# EAGLE design analog3-x893 (EAGLE 7.2.0)
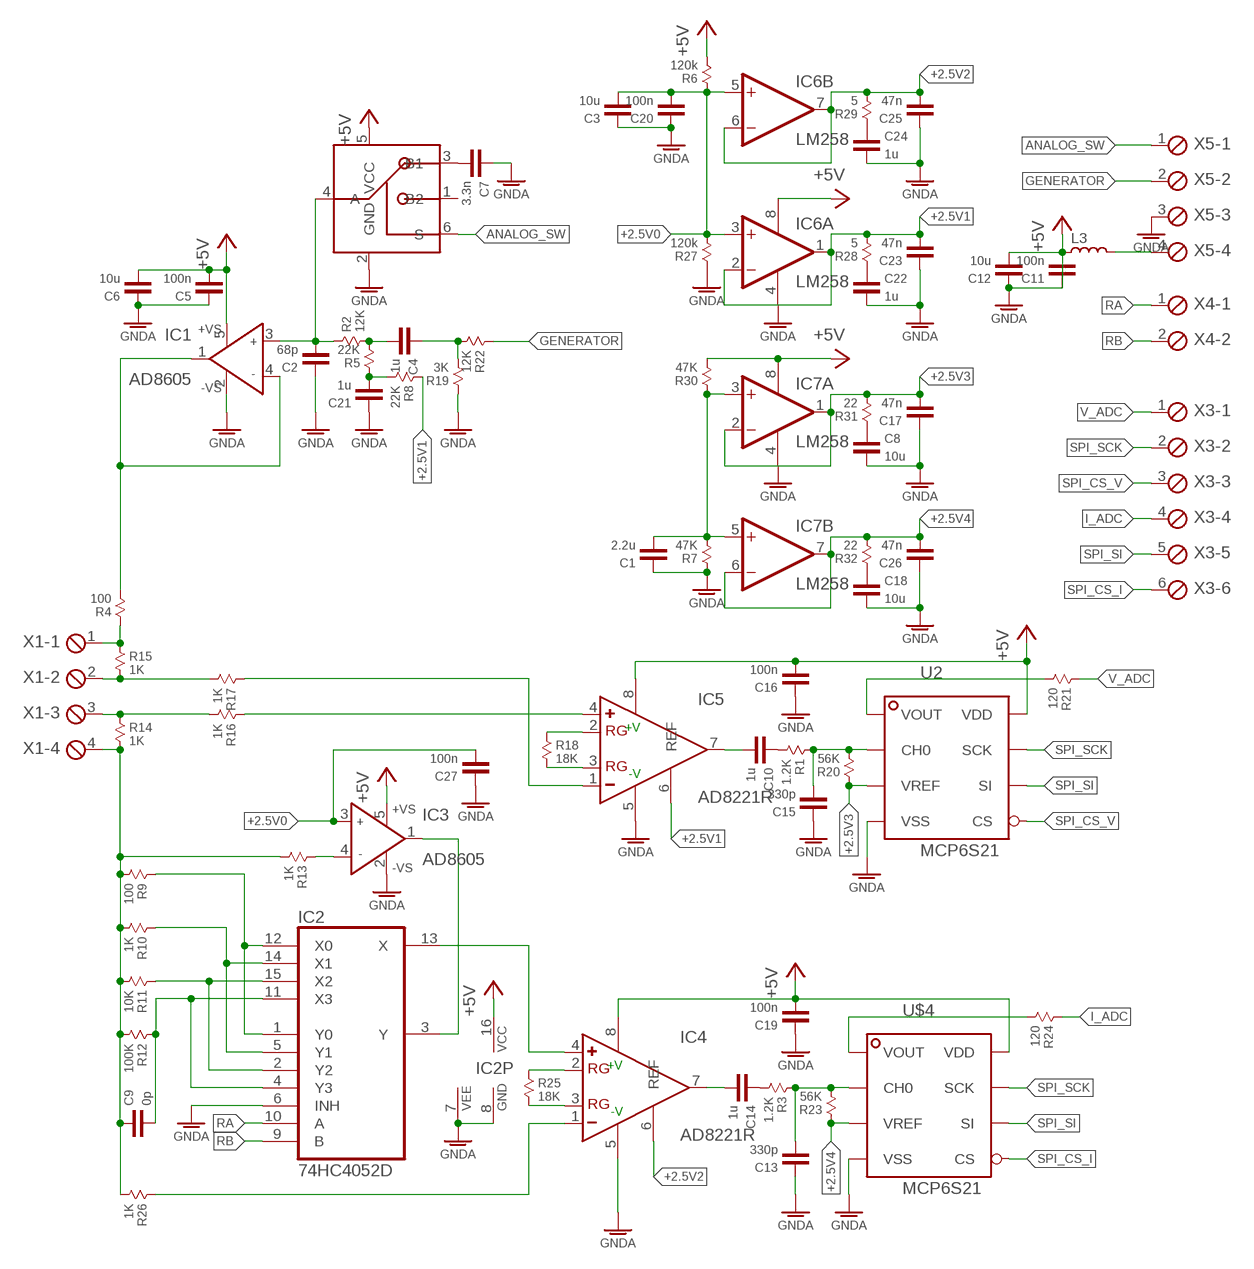
[diagram p0: schematic, sheet 1]

## Parts
C1  2.2u  CAP-0603  [0603]
C2  68p  CAP-0603  [0603]
C3  10u  CAP-0603  [0603]
C4  1u  CAP-0603  [0603]
C5  100n  CAP-0603  [0603]
C6  10u  CAP-0603  [0603]
C7  3.3n  CAP-0603  [0603]
C8  10u  CAP-0603  [0603]
C9  0p  CAP-0603  [0603]
C10  1u  CAP-0603  [0603]
C11  100n  CAP-0603  [0603]
C12  10u  CAP-0603  [0603]
C13  330p  CAP-0603  [0603]
C14  1u  CAP-0603  [0603]
C15  330p  CAP-0603  [0603]
C16  100n  CAP-0603  [0603]
C17  47n  CAP-0603  [0603]
C18  10u  CAP-0603  [0603]
C19  100n  CAP-0603  [0603]
C20  100n  CAP-0603  [0603]
C21  1u  CAP-0603  [0603]
C22  1u  CAP-0603  [0603]
C23  47n  CAP-0603  [0603]
C24  1u  CAP-0603  [0603]
C25  47n  CAP-0603  [0603]
C26  47n  CAP-0603  [0603]
C27  100n  CAP-0603  [0603]
IC1  AD8605  AD8603UJ  [SOT23-5]
IC2  74HC4052D  4052D  [SO16]
IC3  AD8605  AD8603UJ  [SOT23-5]
IC4  AD8221R  [SO8]
IC5  AD8221R  [SO8]
IC6  LM258  LM358D  [SO08]
IC7  LM258  LM358D  [SO08]
L3  INDUCTOR-0603  [0603]
R1  1.2K  RESISTOR-0603  [0603]
R2  12K  RESISTOR-0603  [0603]
R3  1.2K  RESISTOR-0603  [0603]
R4  100  RESISTOR-0603  [0603]
R5  22K  RESISTOR-0603  [0603]
R6  120k  RESISTOR-0603  [0603]
R7  47K  RESISTOR-0603  [0603]
R8  22K  RESISTOR-0603  [0603]
R9  100  RESISTOR-0603  [0603]
R10  1K  RESISTOR-0603  [0603]
R11  10K  RESISTOR-0603  [0603]
R12  100K  RESISTOR-0603  [0603]
R13  1K  RESISTOR-0603  [0603]
R14  1K  RESISTOR-0603  [0603]
R15  1K  RESISTOR-0603  [0603]
R16  1K  RESISTOR-0603  [0603]
R17  1K  RESISTOR-0603  [0603]
R18  18K  RESISTOR-0603  [0603]
R19  3K  RESISTOR-0603  [0603]
R20  56K  RESISTOR-0603  [0603]
R21  120  RESISTOR-0603  [0603]
R22  12K  RESISTOR-0603  [0603]
R23  56K  RESISTOR-0603  [0603]
R24  120  RESISTOR-0603  [0603]
R25  18K  RESISTOR-0603  [0603]
R26  1K  RESISTOR-0603  [0603]
R27  120k  RESISTOR-0603  [0603]
R28  5  RESISTOR-0603  [0603]
R29  5  RESISTOR-0603  [0603]
R30  47K  RESISTOR-0603  [0603]
R31  22  RESISTOR-0603  [0603]
R32  22  RESISTOR-0603  [0603]
U2  MCP6S21  [SO8]
U$1  SN74LVC1G3157DBVR  [SOT23-6]
U$4  MCP6S21  [SO8]
X1  MPT4  [4POL254]
X3  MPT6  [6POL254]
X4  MPT2  [2POL254]
X5  MPT4  [4POL254]

## Nets
+2.5V0: C3.1 C20.1 C27.1 IC3.3(IN+) IC6.3(A:+IN) IC6.5(B:+IN) R6.1 R27.2
+2.5V1: C23.1 IC5.6(REF) IC6.1(A:OUT) IC6.2(A:-IN) R8.1 R28.2
+2.5V2: C25.1 IC4.6(REF) IC6.6(B:-IN) IC6.7(B:OUT) R29.2
+2.5V3: C17.1 IC7.1(A:OUT) IC7.2(A:-IN) R20.1 R31.2 U2.3(VREF)
+2.5V4: C26.1 IC7.6(B:-IN) IC7.7(B:OUT) R23.1 R32.2 U$4.3(VREF)
+5V: C5.1 C6.1 C11.1 C12.1 C16.1 C19.1 IC1.5(+VS) IC2.16(VCC) IC3.5(+VS) IC4.8(+V) IC5.8(+V) IC6.8(P:V+) IC7.8(P:V+) L3.1 R6.2 R30.2 U2.8(VDD) U$1.5(VCC) U$4.8(VDD)
ANALOG_SW: U$1.6(S) X5.1
GENERATOR: R22.1 X5.2
GNDA: C1.2 C2.2 C3.2 C5.2 C6.2 C7.2 C8.1 C11.2 C12.2 C13.2 C15.2 C16.2 C17.2 C18.1 C19.2 C20.2 C21.2 C22.1 C23.2 C24.1 C25.2 C26.2 C27.2 IC1.2(-VS) IC2.6(INH) IC2.7(VEE) IC2.8(GND) IC3.2(-VS) IC4.5(-V) IC5.5(-V) IC6.4(P:V-) IC7.4(P:V-) R7.1 R19.1 R27.1 U2.4(VSS) U$1.2(GND) U$4.4(VSS) X5.3
I_ADC: R24.1 X3.4
N$1: IC5.1(-) R17.1
N$3: C2.1 IC1.3(IN+) R2.1 U$1.4(A)
N$4: C4.1 R2.2 R5.2
N$5: IC1.1(OUT) IC1.4(IN-) R4.2
N$6: L3.2 X5.4
N$7: C7.1 U$1.3(B1)
N$8: IC3.4(IN-) R13.1
N$9: IC4.3(RG) R25.2
N$10: C21.1 R5.1 R8.2
N$11: IC2.3(Y) IC3.1(OUT)
N$12: IC2.1(Y0) IC2.12(X0) R9.1
N$13: IC2.5(Y1) IC2.14(X1) R10.1
N$14: IC2.2(Y2) IC2.15(X2) R11.1
N$15: C9.1 IC2.4(Y3) IC2.11(X3) R12.1
N$16: R14.1 R16.2 X1.3
N$17: R15.2 R17.2 X1.2
N$18: C9.2 R9.2 R10.2 R11.2 R12.2 R13.2 R14.2 R26.2 X1.4
N$19: R4.1 R15.1 X1.1
N$20: C10.1 IC5.7(OUT)
N$21: IC4.2(RG) R25.1
N$22: IC4.1(-) R26.1
N$23: IC5.3(RG) R18.2
N$24: IC5.2(RG) R18.1
N$25: C13.1 R3.1 R23.2 U$4.2(CH0)
N$26: R24.2 U$4.1(VOUT)
N$27: C15.1 R1.1 R20.2 U2.2(CH0)
N$28: R21.2 U2.1(VOUT)
N$29: C14.1 IC4.7(OUT)
N$30: IC2.13(X) IC4.4(+)
N$31: C24.2 R29.1
N$32: IC5.4(+) R16.1
N$33: C8.2 R31.1
N$34: C4.2 R19.2 R22.2
N$35: C18.2 R32.1
N$36: C22.2 R28.1
N$37: C10.2 R1.2
N$38: C14.2 R3.2
N$41: C1.1 IC7.3(A:+IN) IC7.5(B:+IN) R7.2 R30.1
RA: IC2.10(A) X4.1
RB: IC2.9(B) X4.2
SPI_CS_I: U$4.5(CS) X3.6
SPI_CS_V: U2.5(CS) X3.3
SPI_SCK: U2.7(SCK) U$4.7(SCK) X3.2
SPI_SI: U2.6(SI) U$4.6(SI) X3.5
V_ADC: R21.1 X3.1
Unconnected: U$1.1(B2)

## Library data of the parts
C1-C27 = X893:CAP: Capacitor
IC1 IC3 = analog-devices:AD8603: Precision Micropower, Low Noise CMOS, Rail-to-Rail Input/Output Operational Amplifiers Source: http://www.analog.com/static/imported-files/data_sheets/AD8603_8607_8609.pdf; MF: ALTERA CORPORATION; MPN: AD8603AUJZ-REEL7; OC_FARNELL: 1651290; OC_NEWARK: 59K6904
IC2 = 40xx:4052: Dual 4-channel ANALOG MULTIPLEXER
IC4 IC5 = balmer:AD8221: Low Cost, Low Power, Instrumentation Amplifier Source: http://www.analog.com/UploadedFiles/Data_Sheets/37793330023930AD620_e.pdf; MPN: AD620AR; OC_FARNELL: 1464424; OC_NEWARK: 05F7109
IC6 IC7 = linear:LM358: OP AMP also LM158; LM258; LM2904 Source: http://cache.national.com/ds/LM/LM158.pdf
L3 = X893:INDUCTOR: http://www.murata.com/products/catalog/pdf/o05e.pdf
R1-R32 = X893:RESISTOR
U2 U$4 = balmer:MCP6S21: Single-Ended, Rail-to-Rail I/O, Low Gain PGA
U$1 = balmer:SN74LVC1G3157DBVR: SINGLE-POLE DOUBLE-THROW ANALOG SWITCH
X1 X5 = con-phoenix-254:MPT4: PHOENIX CONNECTOR; OC_FARNELL: unknown; OC_NEWARK: unknown
X3 = con-phoenix-254:MPT6: PHOENIX CONNECTOR; OC_FARNELL: unknown; OC_NEWARK: unknown
X4 = con-phoenix-254:MPT2: PHOENIX CONNECTOR; OC_FARNELL: unknown; OC_NEWARK: unknown

## Board
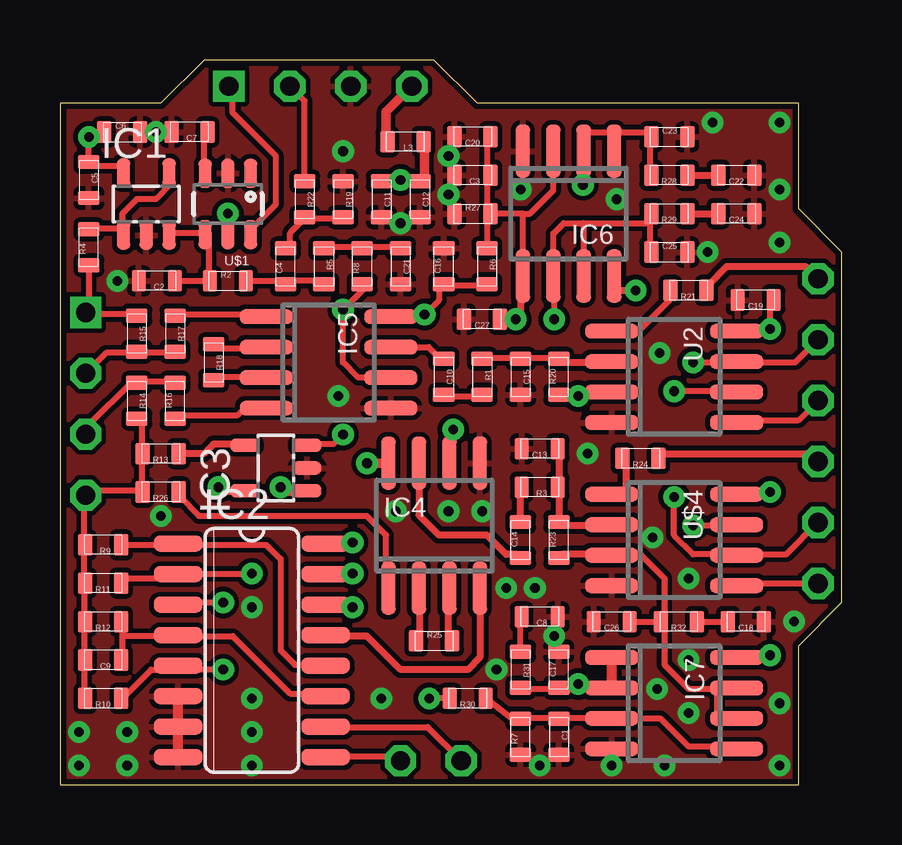
[diagram p1: board, top side]
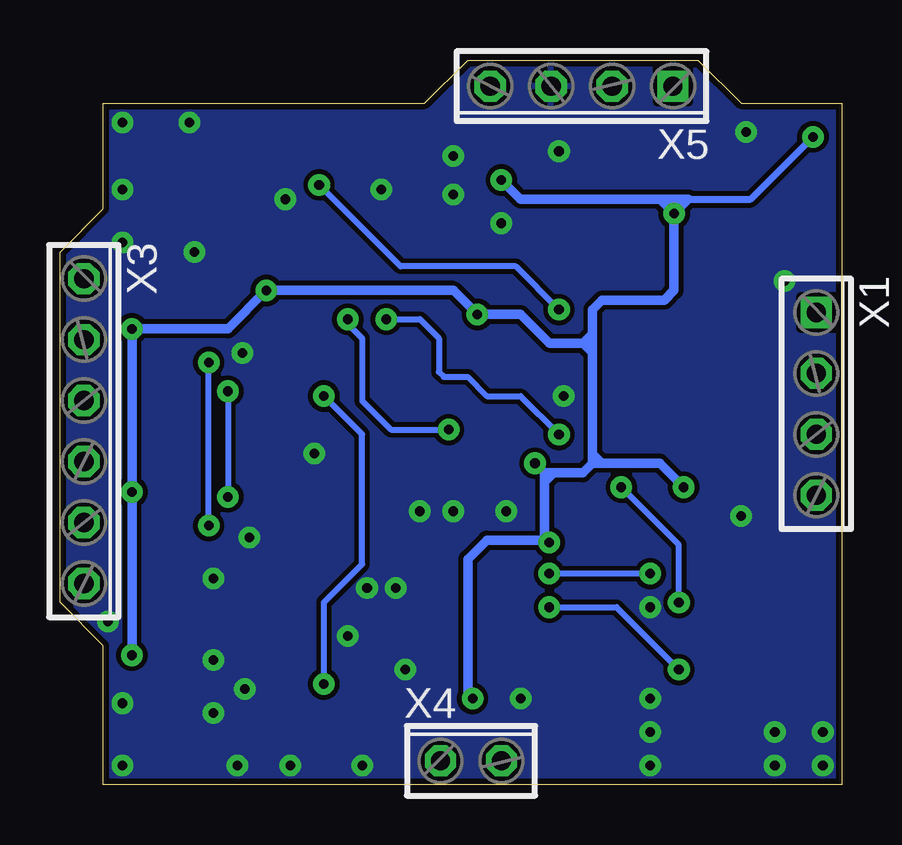
[diagram p2: board, bottom side, seen from below]

Size 32.6 x 30.2 mm. Coordinates in mm from the lower left corner, seen from the top.
Outline: 0,0 30.8,0 30.8,5.8 32.6,7.6 32.6,22.2 30.8,24 30.8,28.4 17.4,28.4 15.6,30.2 6,30.2 4.2,28.4 0,28.4 0,0
Copper layers (1+16): Top 0.035mm / dielectric 1.5mm / Bottom 0.035mm
Design rules "Rezonit": minimum track width 0.2mm, minimum drill 0.4mm, track to track 0.2mm, track to pad 0.2mm, pad to pad 0.2mm, via to via 0.2mm, smd to smd 0mil, copper to edge 0.25mm, drill to drill 0.4mm, minimum pad ring 0.25mm, minimum via ring 0.25mm, stop-mask expansion 4mil, vias tented up to drill 0.4mm, thermal gap 0.2mm

### Footprints (pad centres in the part's own frame; a part is rotated, then mirrored left to right if it is on the bottom)
0603 = smd 0.6 x 0.9: 1 -0.75,0; 2 0.75,0
SOT23-5 = smd 0.55 x 1.2: 1 -0.95,-1.3; 2 0,-1.3; 3 0.95,-1.3; 4 0.95,1.3; 5 -0.95,1.3
SO16 = smd 0.66 x 2.032: 1 -4.445,-3.073; 2 -3.175,-3.073; 3 -1.905,-3.073; 4 -0.635,-3.073; 5 0.635,-3.073; 6 1.905,-3.073; 7 3.175,-3.073; 8 4.445,-3.073; 9 4.445,3.073; 10 3.175,3.073; 11 1.905,3.073; 12 0.635,3.073; 13 -0.635,3.073; 14 -1.905,3.073; 15 -3.175,3.073; 16 -4.445,3.073
SO8 = smd 0.6 x 2.2: 1 -1.905,-2.6; 2 -0.635,-2.6; 3 0.635,-2.6; 4 1.905,-2.6; 5 1.905,2.6; 6 0.635,2.6; 7 -0.635,2.6; 8 -1.905,2.6
SO08 = smd 0.6 x 2.2: 1 -1.905,-2.6; 2 -0.635,-2.6; 3 0.635,-2.6; 4 1.905,-2.6; 5 1.905,2.6; 6 0.635,2.6; 7 -0.635,2.6; 8 -1.905,2.6
SOT23-6 = smd 0.55 x 1.2: 1 -0.95,-1.275; 2 0,-1.275; 3 0.95,-1.275; 4 0.95,1.275; 5 0,1.275; 6 -0.95,1.275
4POL254 = drill 0.8 square: 1 -3.81,0 | drill 0.8 octagon: 2 -1.27,0; 3 1.27,0; 4 3.81,0
6POL254 = drill 0.8 octagon: 1 -6.35,0; 2 -3.81,0; 3 -1.27,0; 4 1.27,0; 5 3.81,0; 6 6.35,0
2POL254 = drill 0.8 octagon: 1 -1.27,0; 2 1.27,0

### Placement (x,y rotation side)
C1  20.8,2 270 top
C2  4.04,21 180 top
C3  17.2,25.4 180 top
C4  9.4,21.6 90 top
C5  1.2,25.2 270 top
C6  2.6,27.2 0 top
C7  5.4,27.2 180 top
C8  20,7 180 top
C9  1.8,5.2 180 top
C10  16,17 270 top
C11  13.4,24.4 270 top
C12  15,24.4 270 top
C13  20,14 180 top
C14  19.2,10.2 90 top
C15  19.2,17 270 top
C16  16,21.6 90 top
C17  20.8,4.8 90 top
C18  28.6,6.8 180 top
C19  29,20.2 180 top
C20  17.2,27 180 top
C21  14.2,21.6 270 top
C22  28.2,25.4 180 top
C23  25.4,27 0 top
C24  28.2,23.8 180 top
C25  25.4,22.2 0 top
C26  23,6.8 180 top
C27  17.6,19.4 180 top
IC1  3.6,24.2 0 top
IC2  8,5.6 270 top
IC3  9,13.2 90 top
IC4  15.6,10.8 0 top
IC5  11.2,17.6 270 top
IC6  21.2,23.8 180 top
IC7  25.6,3.4 270 top
L3  14.4,26.8 180 top
R1  17.6,17 270 top
R2  7,21 0 top
R3  20,12.4 180 top
R4  1.2,22.4 90 top
R5  11,21.6 270 top
R6  17.8,21.6 270 top
R7  19.2,2 90 top
R8  12.6,21.6 90 top
R9  1.8,10 180 top
R10  1.8,3.6 180 top
R11  1.8,8.4 180 top
R12  1.8,6.8 180 top
R13  4.2,13.8 180 top
R14  3.2,16 270 top
R15  3.2,18.8 270 top
R16  4.8,16 90 top
R17  4.8,18.8 270 top
R18  6.4,17.6 270 top
R19  11.8,24.4 270 top
R20  20.8,17 90 top
R21  26.2,20.6 180 top
R22  10.2,24.4 270 top
R23  20.8,10.2 90 top
R24  24.2,13.6 180 top
R25  15.6,6 0 top
R26  4.2,12.2 180 top
R27  17.2,23.8 0 top
R28  25.4,25.4 180 top
R29  25.4,23.8 180 top
R30  17,3.6 180 top
R31  19.2,4.8 270 top
R32  25.8,6.8 180 top
U2  25.6,17 270 top
U$1  7,24.2 180 top
U$4  25.6,10.2 270 top
X1  1.07,15.87 270 bottom
X3  31.6,14.74 270 bottom
X4  15.46,1 0 bottom
X5  10.85,29.11 180 bottom

### Tracks (layer width: path | path; a pad name or v marks a point on that pad's centre or on a via)
+2.5V0  (via drill 0.4)
  Top 0.25: C20.1 17.8,27 17.8,25.4 | C3.1 17.8,25.4 | 17.8,25.4 17.8,23.8 | 17.8,23.8 R6.1 | IC6.5 19.3,23.8 | 19.3,23.8 19.6,23.8 20.57,24.77 IC6.3 | 19.3,23.8 R27.2 17.8,23.8 | v11.8,14.6 11.4,14.2 10.6,14.2 10.6,14.15
  Top 0.3: IC6.5 19.3,20.89 19.2,20.8 19.2,19.6 v19,19.4 C27.1 | 10.6,14.15 IC3.3
  Bottom 0.25: v19,19.4 17.6,19.4 16.8,18.6 16.8,17.2 16.6,17 15.6,17 14.8,16.2 13.4,16.2 v11.8,14.6
+2.5V1  (via drill 0.4)
  Top 0.25: IC6.1 23.11,27.2 | 23.11,27.2 24.6,27.2 | IC6.2 21.84,27.2 23.11,27.2 | C23.1 24.6,27.2 | 24.6,27.2 24.6,25.4 R28.2 | IC5.6 12.44,16.96 11.8,17.6 v11.8,19.8 12.8,20.8 R8.1 | 21.8,26.6 v21.8,25
  Top 0.3: IC6.2 21.8,26.6
  Bottom 0.25: v11.8,19.8 13.6,21.6 18.4,21.6 v21.8,25
+2.5V2  (via drill 0.4)
  Top 0.25: R29.2 24.6,24 24.6,23.4 | 24.6,23.4 24.6,22.2 C25.1 | IC6.7 21.84,23.4 | 21.84,23.4 24.6,23.4 | IC6.6 20.57,22.96 21,23.4 21.84,23.4 | 20.6,21.4 v20.6,19.4 | v16.4,14.8 16.2,14.8 16.2,13.44
  Top 0.3: IC6.6 20.6,21.4 | 16.2,13.44 IC4.6
  Bottom 0.25: 20.6,19.2 20,18.6 20,16 18.8,14.8 v16.4,14.8
  Bottom 0.3: v20.6,19.4 20.6,19.2
+2.5V3  (via drill 0.4)
  Top 0.25: R20.1 20.8,16.2 v21.6,16.2 23,16.2 U2.3 | R31.2 19.2,4 20.8,4 C17.1
  Top 0.3: 20.8,4 21.6,4 | v21.6,4.2 21.6,4 | 21.6,4 23,4 IC7.2
  Top 0.406: IC7.2 IC7.1
  Bottom 0.25: v21.6,4.2 21.6,7.6 20,9.2 20,14.6 v21.6,16.2
+2.5V4
  Top 0.25: 27.57,4.04 27.4,4 | IC7.6 27.57,2.77 27.4,2.8 27.4,4 | 23.4,9.6 24.2,9.6 25.2,8.6 25.2,6.8 | 25.2,6.8 25.2,5 26.2,4 27.4,4 | 27.4,4 28.16,4 | C26.1 R32.2 25.2,6.8
  Top 0.3: R23.1 20.95,9.6 22.6,9.6 22.64,9.56 U$4.3 23.36,9.56 23.4,9.6 | 27.57,4.04 IC7.7 28.16,4
+5V  (via drill 0.4)
  Top 0.25: R6.2 17.8,20.8 16,20.8 | C16.1 16,20.8 | 16,20.8 15.8,20.8 15.8,20.2 v15.2,19.6 15.11,19.5 IC5.8 | C19.1 29.6,20.2 v29.6,19 | 7.6,12.2 6.8,12.2 v6.6,12.4 | R30.2 v15.4,3.6 | 1.85,27.25 1.8,27.2 1.4,27.2 v1.2,27 C5.1 | 1.2,25.8 2.65,25.8 IC1.5
  Top 0.3: IC6.8 23.11,20.6 v24,20.6 | U2.8 28.7,18.91 28.8,19 v29.6,19 | U$4.8 28.91,12.11 29,12.2 v29.6,12.2 | IC3.5 7.65,12.25 7.6,12.2 | IC7.8 27.89,5.3 27.8,5.4 v29.6,5.4 | C6.1 1.85,27.25 | 1.2,25.8 C5.1 | C12.1 15.2,25.2 v14.2,25.2 13.4,25.2 C11.1 | 15.2,26.8 L3.1 | U$1.5 v7,23.8 | IC2.16 12.2,10.04 v12.2,10.1
  Top 0.4: 15.2,25.2 15.2,26.8 | v12.8,13.4 IC4.8
  Bottom 0.3: 6.4,24.4 3.8,24.4 v1.2,27 | 7,24.4 v7,23.8 | 12.4,10.3 v12.2,10.1
  Bottom 0.4: v7,23.8 7.6,24.4 | 7.6,24.4 13.4,24.4 v14.2,25.2 | v7,23.8 6.4,24.4 7,24.4 7.6,24.4 | v29.6,5.4 v29.6,12.2 v29.6,19 25.6,19 v24,20.6 16.2,20.6 v15.2,19.6 13.4,19.6 12.2,18.4 10.8,18.4 | v6.6,12.4 7.6,13.4 10,13.4 | 10,13.4 10.4,13.4 | 10.4,13.4 10.8,13 12,13 | 12,13 12.4,13 | 12.4,13 v12.8,13.4 | 12.4,13 12.4,12.6 | 12.4,12.6 12.4,10.3 | v15.4,3.6 15.6,3.8 15.6,9.4 14.8,10.2 12.3,10.2 v12.2,10.1 | v7,23.8 7,20.6 7.4,20.2 10,20.2 10.4,19.8 10.4,18.8 | 10.4,18.8 10.4,18.4 | 10.4,18.4 10.4,18 | 10.4,18 10.4,13.8 | 10.4,13.8 10.4,13.4 | 10.8,18.4 10.4,18.4 | 10.8,18.4 10.4,18.8 | 10.8,18.4 10.4,18 | 10,13.4 10.4,13.8 | 12.4,12.6 12,13
ANALOG_SW
  Top 0.25: U$1.6 7.95,23.2 | 8,23.2 9,24.2 9,26.2 7.2,28 7.2,28.95 X5.1
  Top 0.3: 7.95,23.2 8,23.2
GENERATOR
  Top 0.25: R22.1 10.2,28.5 X5.2
GNDA  (via drill 0.4)
  Top 0.406: IC2.6 IC2.7 IC2.8
  other vias: 4,27.2 19.2,24.8 0.8,0.8 2.8,0.8 2.8,2.2 0.8,2.2 8,2.2 8,0.8 8,3.6 8,7.4 13.4,3.6 19.8,8.2 18.2,4.8 18.6,8.2 16.2,11.4 17.6,11.4 14,11.4 20,0.8 23,0.8 25.2,0.8 26.2,3 30,3.4 30,0.8 30.6,6.8 26.2,8.6 25,18 30,27.6 30,24.8 27.2,27.6 11.8,26.4 14.2,23.4 16.2,24.6 16.2,26.2 23.2,24.4 27,22.2 30,22.6 2.4,21 4.2,11.2 11.6,16.2 24.7,10.3 22,13.8 26.2,5.2 24.9,4 20.6,6.2
  pour Top (isolate 0.2, rank 2): 0,0 30.8,0 30.8,5.8 32.6,7.6 32.6,22.2 30.8,24 30.8,28.4 17.4,28.4 15.6,30.2 6,30.2 4.2,28.4 0,28.4
  pour Bottom: 0,28.4 4.2,28.4 6,30.2 15.6,30.2 17.4,28.4 30.8,28.4 30.8,24 32.6,22.2 32.6,7.6 30.8,5.8 30.8,0 0,0
I_ADC
  Top 0.3: R24.1 25,13.6 25,13.8 31.53,13.8 X3.4
N$1
  Top 0.25: R17.1 4.8,19.6 8.49,19.6 IC5.1
N$3
  Top 0.25: IC1.3 4.55,23.05 | 4.6,23 6.2,23 | U$1.4 6.05,23 6.2,23 | 6.2,23 6.2,21 | C2.1 6.2,21 | R2.1 6.2,21
  Top 0.3: 4.55,23.05 4.6,23
N$4
  Top 0.25: R5.2 11,21 9.4,21 | R2.2 9.4,21 | 9.4,21 C4.1
N$5
  Top 0.25: IC1.4 4.6,25.3 4.6,25 4,24.4 3.2,24.4 2.6,23.8 2.6,22.75 | R4.2 1.2,23.2 2.55,23.2 IC1.1
  Top 0.3: 2.6,22.75 IC1.1
N$6
  Top 0.4: L3.2 13.6,26.8 13.6,28.05 X5.4
N$7
  Top 0.25: U$1.3 6.03,25.57 | 6,25.6 6,27.2
  Top 0.3: 6.03,25.57 6,25.6 | 6,27.2 C7.1
N$8
  Top 0.3: IC3.4 7.65,14.15 7.6,14.2 6.4,14.2 6,13.8 R13.1
N$9
  Top 0.3: R25.2 16.2,6 16.2,8.2 IC4.3
N$10
  Top 0.25: C21.1 14.2,22.4 12.65,22.4 | R8.2 12.6,22.4 11.05,22.4 R5.1
  Top 0.3: 12.65,22.4 R8.2
N$11  (via drill 0.4)
  Top 0.25: 5.2,7.6 v6.8,7.6
  Top 0.3: IC2.3 5.11,7.5 5.2,7.6 | v9.2,12.4 9.4,12.2 10.25,12.2 IC3.1
  Bottom 0.25: v6.8,7.6 6.8,10 v9.2,12.4
N$12
  Top 0.25: 2.55,9.95 2.6,10 4.88,10 | IC2.1 5.75,10.04 | 5.8,10 8.6,10 9.2,9.4 9.2,5.6 9.8,5 11.04,5
  Top 0.3: R9.1 2.55,9.95 | 4.88,10 IC2.1 | 5.75,10.04 5.8,10 | 11.04,5 IC2.12
N$13  (via drill 0.4)
  Top 0.25: R10.1 2.55,3.55 3.8,4.8 4.76,4.8 | v6.8,4.8 5.09,4.8 IC2.5
  Top 0.3: 4.76,4.8 IC2.5 | IC2.14 10.71,7.5 10.6,7.4 v12.2,7.4
  Bottom 0.25: v12.2,7.4 9.4,7.4 v6.8,4.8
N$14  (via drill 0.4)
  Top 0.25: 2.55,8.35 2.6,8.6 4.7,8.6 | 5.4,8.8 v8,8.8
  Top 0.3: R11.1 2.55,8.35 | 4.7,8.6 IC2.2 5.38,8.78 5.4,8.8 | v12.2,8.8 11.05,8.8 IC2.15
  Bottom 0.25: v8,8.8 v12.2,8.8
N$15
  Top 0.25: R12.1 2.6,6.8 2.6,6.2 | 2.6,6.2 2.6,5.25 C9.1 | 4.4,6.2 2.6,6.2 | 5.6,6.2 7.2,6.2 9.6,3.8 10.97,3.8
  Top 0.3: 4.4,6.2 4.43,6.24 IC2.4 5.57,6.24 5.6,6.2 | 10.97,3.8 IC2.11
N$16
  Top 0.25: R16.2 4.8,16.8 3.25,16.8 R14.1 3.2,16.8 3,16.8 1.2,15 1.2,14.73 X1.3
N$17
  Top 0.25: R17.2 4.8,18 3.25,18 R15.2 3.2,18 1.93,18 X1.2
N$18
  Top 0.25: R14.2 3.35,15.25 | 3.4,15.2 3.4,13.85 | R13.2 3.4,13.8 3.4,12.25 | 3.4,12.25 R26.2 | 3.4,12.25 1.26,12.25 X1.4 1,11.99 1,10 R9.2 1,9.95 1,8.4 | R11.2 1,8.4 | 1,8.4 1,6.85 R12.2 1,6.8 1,5.25 C9.2 1,5.2 1,3.65 R10.2
  Top 0.3: 3.35,15.25 3.4,15.2 | 3.4,13.85 R13.2
N$19
  Top 0.25: R4.1 1.2,19.81 X1.1 1.15,19.6 3.2,19.6 R15.1
N$20
  Top 0.25: IC5.7 15.37,18.23 15.8,17.8 15.95,17.8 C10.1
N$21
  Top 0.3: R25.1 15,6 15,8.2 IC4.2
N$22
  Top 0.25: IC4.1 13.7,8.9 13.6,9 13.6,10.4 12.8,11.2 5.8,11.2 5,12 R26.1
N$23
  Top 0.25: R18.2 6.4,17 8.56,17 IC5.3
N$24
  Top 0.25: R18.1 6.4,18.2 8.56,18.2 IC5.2
N$25
  Top 0.3: U$4.2 22.84,10.84 22.8,10.8 20.95,10.8 R23.2 20.8,12.4 | C13.1 20.8,14 20.8,12.4 | 20.8,12.4 R3.1
N$26
  Top 0.3: R24.2 23.6,13.6 23.6,12 22.89,12 U$4.1
N$27
  Top 0.25: R1.1 17.6,17.8 19.2,17.8 20.8,17.8 R20.2
  Top 0.3: C15.1 19.2,17.8 | R20.2 20.8,17.6 23,17.6 U2.2
N$28
  Top 0.25: U2.1 24.11,18.91 25.4,20.2 | 25.4,20.35 R21.2
  Top 0.3: 25.4,20.2 25.4,20.35
N$29
  Top 0.3: IC4.7 14.96,11.23 15.8,10.4 17.8,10.4 18.6,9.6 19.05,9.6 C14.1
N$30
  Top 0.3: IC4.4 17.5,5.3 17,4.8 14.2,4.8 12.8,6.2 11.11,6.2 IC2.13
N$31
  Top 0.3: R29.1 C24.2
N$32
  Top 0.25: R16.1 4.8,15.4 7.4,15.4 7.6,15.6 8.3,15.6
  Top 0.3: 8.3,15.6 IC5.4
N$33
  Top 0.25: R31.1 19.2,7 C8.2
N$34
  Top 0.25: C4.2 9.6,22.4 9.6,23 10.2,23.6 | R22.2 10.2,23.6 | 10.2,23.6 11.8,23.6 R19.2
N$35
  Top 0.25: R32.1 C18.2
N$36
  Top 0.3: R28.1 C22.2
N$37
  Top 0.25: 16,16.2 17.6,16.2
  Top 0.3: C10.2 16,16.2 | 17.6,16.2 R1.2
N$38
  Top 0.3: C14.2 19.2,12.4 R3.2
N$41
  Top 0.25: 28.3,1.5 IC7.5 28.09,1.6 26.2,1.6 25.04,2.77 IC7.3 22.96,2.8 20.8,2.8 | R30.1 18.8,2.8 19.15,2.8 | R7.2 19.2,2.8 20.75,2.8 C1.1
  Top 0.3: 28.3,1.5 28.4,1.4 | 19.15,2.8 R7.2 | C1.1 20.8,2.8
RA
  Top 0.25: IC2.10 11.4,2.42 | 11.4,2.42 11.4,2.4 | 11.4,2.42 11.78,2.42 11.8,2.4 15.33,2.4 X4.1
RB
  Top 0.25: IC2.9 11.76,1.16 11.8,1.2 13.99,1.2 X4.2
SPI_CS_I
  Top 0.25: U$4.5 28.7,8.29 28.8,8.4 31.21,8.4 X3.6
SPI_CS_V
  Top 0.25: 28.7,15.1 28.8,15.2 30.79,15.2 X3.3
  Top 0.3: U2.5 28.7,15.1
SPI_SCK  (via drill 0.4)
  Top 0.25: v26.4,17.6 28.23,17.6 | 28.23,17.6 U2.7 | U$4.7 28.57,10.84 28.6,10.8 v26.4,10.8 | 28.23,17.6 30.65,17.6 X3.2
  Top 0.3: U$4.7 28.36,10.84
  Bottom 0.25: v26.4,10.8 v26.4,17.6
SPI_SI  (via drill 0.4)
  Top 0.25: U2.6 28.96,16.36 | 29,16.4 v25.6,16.4 | U$4.6 28.77,9.56 28.8,9.6 | 28.8,9.6 26.4,9.6 25.6,10.4 v25.6,12 | 28.8,9.6 30.27,9.6 X3.5
  Top 0.3: 28.96,16.36 29,16.4
  Bottom 0.25: v25.6,16.4 v25.6,12
V_ADC
  Top 0.3: R21.1 27,20.8 27.8,21.6 31.09,21.6 X3.1